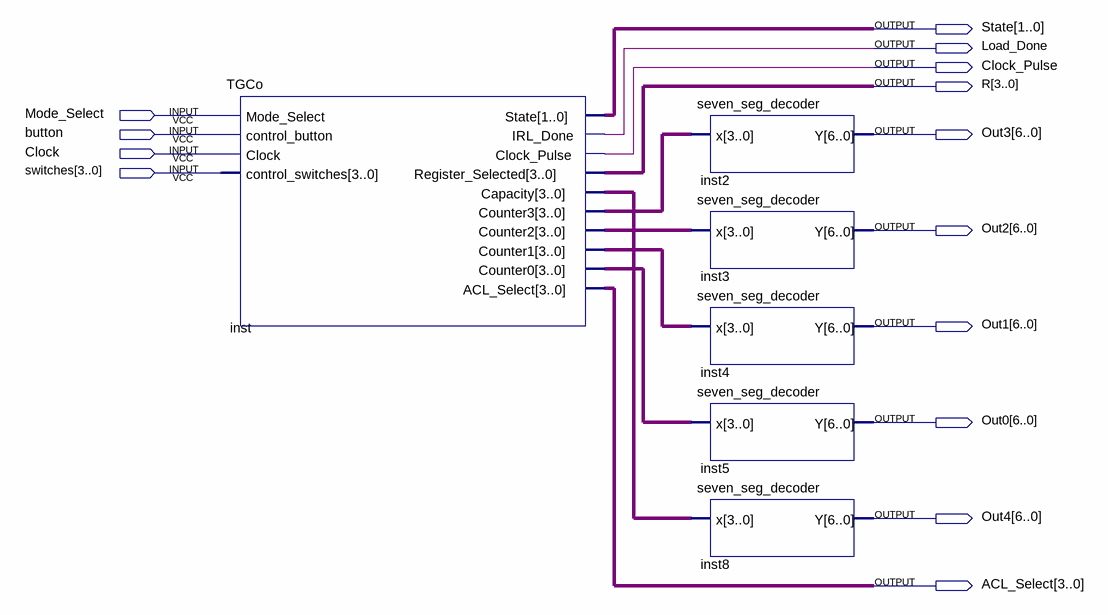
[diagram p0: schematic sheet]
// Quartus schematic TGCo_Test.bdf as structural Verilog: 6 symbols, 14 pins
module TGCo_Test (
  input  Mode_Select,
  input  button,
  input  Clock,
  input  [3:0] switches,
  output [1:0] State,
  output Load_Done,
  output Clock_Pulse,
  output [3:0] R,
  output [6:0] Out3,
  output [6:0] Out2,
  output [6:0] Out1,
  output [6:0] Out0,
  output [6:0] Out4,
  output [3:0] ACL_Select
);

  wire [3:0] inst_capacity, inst_counter0, inst_counter1, inst_counter2, inst_counter3;

  TGCo inst (
    .Mode_Select(Mode_Select), .control_button(button), .Clock(Clock), .control_switches(switches),
    .State(State), .IRL_Done(Load_Done), .Clock_Pulse(Clock_Pulse), .Register_Selected(R),
    .Capacity(inst_capacity), .Counter3(inst_counter3), .Counter2(inst_counter2), .Counter1(inst_counter1),
    .Counter0(inst_counter0), .ACL_Select(ACL_Select));
  seven_seg_decoder inst2 (.x(inst_counter3), .Y(Out3));
  seven_seg_decoder inst3 (.x(inst_counter2), .Y(Out2));
  seven_seg_decoder inst4 (.x(inst_counter1), .Y(Out1));
  seven_seg_decoder inst5 (.x(inst_counter0), .Y(Out0));
  seven_seg_decoder inst8 (.x(inst_capacity), .Y(Out4));
endmodule
